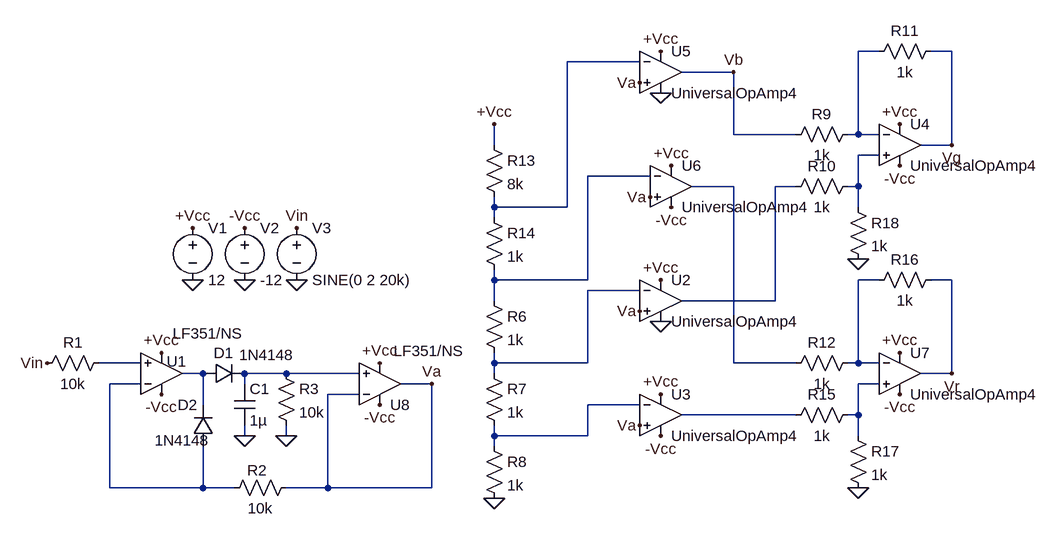
[diagram p0: schematic window_comparator.asc]
window_comparator.asc, the LTspice schematic file:
Version 4
SHEET 1 2020 680
WIRE 1184 -336 1152 -336
WIRE 1296 -336 1264 -336
WIRE 816 -320 704 -320
WIRE 960 -304 880 -304
WIRE 960 -208 960 -304
WIRE 1056 -208 960 -208
WIRE 1152 -208 1152 -336
WIRE 1152 -208 1136 -208
WIRE 1184 -208 1152 -208
WIRE 592 -192 592 -224
WIRE 1296 -192 1296 -336
WIRE 1296 -192 1248 -192
WIRE 1184 -176 1152 -176
WIRE 832 -144 736 -144
WIRE 960 -128 896 -128
WIRE 1056 -128 1024 -128
WIRE 1152 -128 1152 -176
WIRE 1152 -128 1136 -128
WIRE 592 -96 592 -112
WIRE 704 -96 704 -320
WIRE 704 -96 592 -96
WIRE 1152 -96 1152 -128
WIRE 592 -80 592 -96
WIRE 592 16 592 0
WIRE 736 16 736 -144
WIRE 736 16 592 16
WIRE 1184 16 1152 16
WIRE 1296 16 1264 16
WIRE 816 32 736 32
WIRE 592 48 592 16
WIRE 1024 48 1024 -128
WIRE 1024 48 880 48
WIRE 48 144 -16 144
WIRE 592 144 592 128
WIRE 736 144 736 32
WIRE 736 144 592 144
WIRE 960 144 960 -128
WIRE 1056 144 960 144
WIRE 1152 144 1152 16
WIRE 1152 144 1136 144
WIRE 1184 144 1152 144
WIRE 144 160 112 160
WIRE 272 160 208 160
WIRE 384 160 272 160
WIRE 592 160 592 144
WIRE 1296 160 1296 16
WIRE 1296 160 1248 160
WIRE 48 176 0 176
WIRE 208 176 208 160
WIRE 496 176 448 176
WIRE 1184 176 1152 176
WIRE 384 192 336 192
WIRE 144 208 144 160
WIRE 816 208 736 208
WIRE 1056 224 880 224
WIRE 1152 224 1152 176
WIRE 1152 224 1136 224
WIRE 208 256 208 240
WIRE 272 256 272 240
WIRE 592 256 592 240
WIRE 736 256 736 208
WIRE 736 256 592 256
WIRE 1152 256 1152 224
WIRE 592 272 592 256
WIRE 0 336 0 176
WIRE 144 336 144 272
WIRE 144 336 0 336
WIRE 192 336 144 336
WIRE 336 336 336 192
WIRE 336 336 272 336
WIRE 496 336 496 176
WIRE 496 336 336 336
FLAG 208 16 0
FLAG 128 16 0
FLAG 288 16 0
FLAG 128 -64 +Vcc
FLAG 208 -64 -Vcc
FLAG 288 -64 Vin
FLAG 848 256 -Vcc
FLAG 592 352 0
FLAG 864 -96 -Vcc
FLAG 816 240 Va
FLAG 816 64 Va
FLAG 832 -112 Va
FLAG 816 -288 Va
FLAG 960 -304 Vb
FLAG 1216 192 -Vcc
FLAG 1152 336 0
FLAG 1216 -160 -Vcc
FLAG 1152 -16 0
FLAG 1296 -192 Vg
FLAG 1296 160 Vr
FLAG 848 80 0
FLAG 848 -272 0
FLAG -96 144 Vin
FLAG 496 176 Va
FLAG 848 -336 +Vcc
FLAG 1216 -224 +Vcc
FLAG 864 -160 +Vcc
FLAG 848 16 +Vcc
FLAG 1216 128 +Vcc
FLAG 848 192 +Vcc
FLAG 592 -224 +Vcc
FLAG 208 256 0
FLAG 272 256 0
FLAG 80 192 -Vcc
FLAG 416 208 -Vcc
FLAG 80 128 +Vcc
FLAG 416 144 +Vcc
SYMBOL voltage 128 -80 R0
WINDOW 123 0 0 Left 0
WINDOW 39 0 0 Left 0
SYMATTR InstName V1
SYMATTR Value 12
SYMBOL voltage 208 -80 R0
WINDOW 123 0 0 Left 0
WINDOW 39 0 0 Left 0
SYMATTR InstName V2
SYMATTR Value -12
SYMBOL voltage 288 -80 R0
WINDOW 123 0 0 Left 0
WINDOW 39 0 0 Left 0
SYMATTR InstName V3
SYMATTR Value SINE(0 2 20k)
SYMBOL OpAmps\\UniversalOpAmp4 848 48 R0
SYMATTR InstName U2
SYMBOL OpAmps\\UniversalOpAmp4 848 224 R0
SYMATTR InstName U3
SYMBOL res 576 32 R0
SYMATTR InstName R6
SYMATTR Value 1k
SYMBOL res 576 144 R0
SYMATTR InstName R7
SYMATTR Value 1k
SYMBOL res 576 256 R0
SYMATTR InstName R8
SYMATTR Value 1k
SYMBOL OpAmps\\UniversalOpAmp4 848 -304 R0
SYMATTR InstName U5
SYMBOL OpAmps\\UniversalOpAmp4 864 -128 R0
SYMATTR InstName U6
SYMBOL res 576 -208 R0
SYMATTR InstName R13
SYMATTR Value 8k
SYMBOL res 576 -96 R0
SYMATTR InstName R14
SYMATTR Value 1k
SYMBOL OpAmps\\UniversalOpAmp4 1216 160 R0
SYMATTR InstName U7
SYMBOL res 1152 128 R90
WINDOW 0 0 56 VBottom 2
WINDOW 3 32 56 VTop 2
SYMATTR InstName R12
SYMATTR Value 1k
SYMBOL res 1152 208 R90
WINDOW 0 0 56 VBottom 2
WINDOW 3 32 56 VTop 2
SYMATTR InstName R15
SYMATTR Value 1k
SYMBOL res 1280 0 R90
WINDOW 0 0 56 VBottom 2
WINDOW 3 32 56 VTop 2
SYMATTR InstName R16
SYMATTR Value 1k
SYMBOL res 1136 240 R0
SYMATTR InstName R17
SYMATTR Value 1k
SYMBOL OpAmps\\UniversalOpAmp4 1216 -192 R0
SYMATTR InstName U4
SYMBOL res 1152 -224 R90
WINDOW 0 0 56 VBottom 2
WINDOW 3 32 56 VTop 2
SYMATTR InstName R9
SYMATTR Value 1k
SYMBOL res 1152 -144 R90
WINDOW 0 0 56 VBottom 2
WINDOW 3 32 56 VTop 2
SYMATTR InstName R10
SYMATTR Value 1k
SYMBOL res 1280 -352 R90
WINDOW 0 0 56 VBottom 2
WINDOW 3 32 56 VTop 2
SYMATTR InstName R11
SYMATTR Value 1k
SYMBOL res 1136 -112 R0
SYMATTR InstName R18
SYMATTR Value 1k
SYMBOL diode 144 176 R270
WINDOW 0 32 32 VTop 2
WINDOW 3 60 98 VBottom 2
SYMATTR InstName D1
SYMATTR Value 1N4148
SYMBOL cap 192 176 R0
SYMATTR InstName C1
SYMATTR Value 1µ
SYMBOL uA741 80 224 M180
WINDOW 0 8 83 Left 2
WINDOW 3 17 126 Left 2
SYMATTR InstName U1
SYMATTR Value LF351/NS
SYMBOL uA741 416 240 M180
WINDOW 3 21 115 Left 2
SYMATTR InstName U8
SYMATTR Value LF351/NS
SYMBOL res 0 128 R90
WINDOW 0 0 56 VBottom 2
WINDOW 3 32 56 VTop 2
SYMATTR InstName R1
SYMATTR Value 10k
SYMBOL diode 160 272 R180
WINDOW 0 24 64 Left 2
WINDOW 3 6 9 Left 2
SYMATTR InstName D2
SYMATTR Value 1N4148
SYMBOL res 288 320 R90
WINDOW 0 5 61 VBottom 2
WINDOW 3 32 56 VTop 2
SYMATTR InstName R2
SYMATTR Value 10k
SYMBOL res 256 144 R0
SYMATTR InstName R3
SYMATTR Value 10k

The netlist it stands for:
* window_comparator.asc
V1 +Vcc 0 12
V2 -Vcc 0 -12
V3 Vin 0 SINE(0 2 20k)
* U2: UniversalOpAmp4 (symbol OpAmps\UniversalOpAmp4 not available, pins judged from their places): In+=Va In-=N008 V+=+Vcc V-=0 OUT=N006
* U3: UniversalOpAmp4 (symbol OpAmps\UniversalOpAmp4 not available, pins judged from their places): In+=Va In-=N014 V+=+Vcc V-=-Vcc OUT=N015
R6 N004 N008 1k
R7 N008 N014 1k
R8 N014 0 1k
* U5: UniversalOpAmp4 (symbol OpAmps\UniversalOpAmp4 not available, pins judged from their places): In+=Va In-=N002 V+=+Vcc V-=0 OUT=Vb
* U6: UniversalOpAmp4 (symbol OpAmps\UniversalOpAmp4 not available, pins judged from their places): In+=Va In-=N004 V+=+Vcc V-=-Vcc OUT=N005
R13 +Vcc N002 8k
R14 N002 N004 1k
* U7: UniversalOpAmp4 (symbol OpAmps\UniversalOpAmp4 not available, pins judged from their places): In+=N013 In-=N007 V+=+Vcc V-=-Vcc OUT=Vr
R12 N007 N005 1k
R15 N013 N015 1k
R16 Vr N007 1k
R17 N013 0 1k
* U4: UniversalOpAmp4 (symbol OpAmps\UniversalOpAmp4 not available, pins judged from their places): In+=N003 In-=N001 V+=+Vcc V-=-Vcc OUT=Vg
R9 N001 Vb 1k
R10 N003 N006 1k
R11 Vg N001 1k
R18 N003 0 1k
D1 N010 N011 1N4148
C1 N011 0 1µ
* U1: LF351/NS (symbol uA741 not available, pins judged from their places): In+=N009 In-=N012 V+=-Vcc V-=+Vcc OUT=N010
* U8: LF351/NS (symbol uA741 not available, pins judged from their places): In+=N011 In-=Va V+=-Vcc V-=+Vcc OUT=Va
R1 N009 Vin 10k
D2 N012 N010 1N4148
R2 Va N012 10k
R3 N011 0 10k
.model D D
.lib standard.dio
.backanno
.end